# EAGLE design TController (EAGLE 7.7.0)
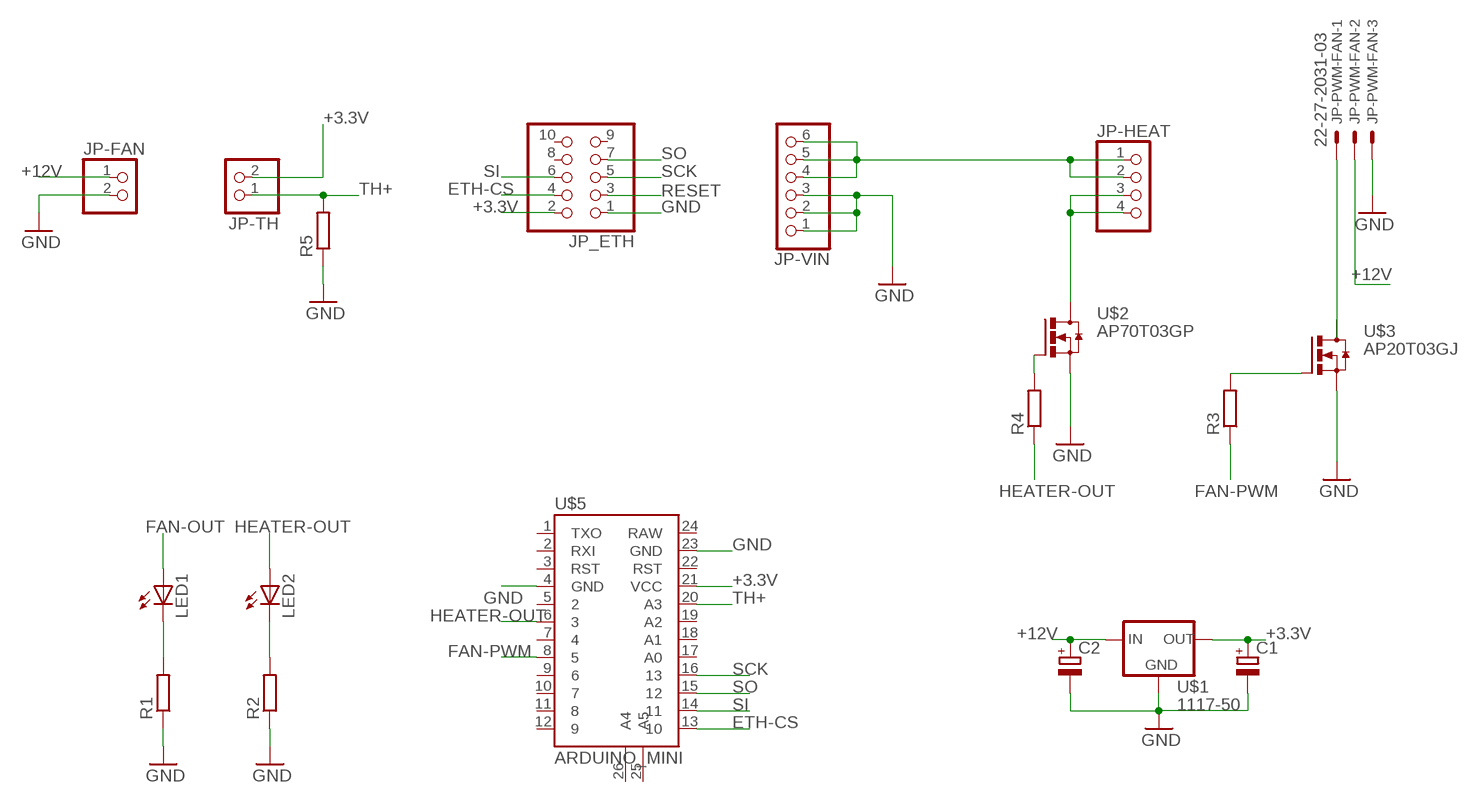
[diagram p0: schematic, sheet 1]

## Parts
C1  CPOL-EUE2.5-6  [E2,5-6]
C2  CPOL-EUE2.5-6  [E2,5-6]
JP-FAN  PINHD-1X2  [1X02]
JP-HEAT  PINHD-1X4  [1X04]
JP-PWM-FAN  22-27-2031-03  [6410-03]
JP-TH  PINHD-1X2  [1X02]
JP-VIN  PINHD-1X6  [1X06]
JP_ETH  PINHD-2X5  [2X05]
LED1  LED3MM  [LED3MM]
LED2  LED3MM  [LED3MM]
R1  R-EU_0207/10  [0207/10]
R2  R-EU_0207/10  [0207/10]
R3  R-EU_0207/10  [0207/10]
R4  R-EU_0207/10  [0207/10]
R5  R-EU_0207/10  [0207/10]
U$1  1117-50  [SOT223]
U$2  AP70T03GP  [TO220V]
U$3  AP20T03GJ  [TO-251]
U$5  ARDUINO_MINI  [ARDUINO_MINI]

## Nets
+3.3V: C1.+ JP-TH.2 JP_ETH.2 U$1.2(OUT) U$1.4(OUT) U$5.21(VCC)
+12V: C2.+ JP-FAN.1 JP-HEAT.1 JP-HEAT.2 JP-PWM-FAN.2 JP-VIN.4 JP-VIN.5 JP-VIN.6 U$1.3(IN)
ETH-CS: JP_ETH.4 U$5.13
FAN-OUT: LED1.A
FAN-PWM: R3.1 U$5.8
GND: C1.- C2.- JP-FAN.2 JP-PWM-FAN.3 JP-VIN.1 JP-VIN.2 JP-VIN.3 JP_ETH.1 R1.1 R2.1 R5.1 U$1.1(GND) U$2.3(S) U$3.S U$5.4(GND) U$5.23(GND)
HEATER-OUT: LED2.A R4.1 U$5.6
N$1: R3.2 U$3.G
N$2: R4.2 U$2.1(G)
N$3: JP-PWM-FAN.1 U$3.D
N$7: JP-HEAT.3 JP-HEAT.4 U$2.2(D)
N$8: LED1.K(C) R1.2
N$9: LED2.K(C) R2.2
RESET: JP_ETH.3
SCK: JP_ETH.5 U$5.16
SI: JP_ETH.6 U$5.14
SO: JP_ETH.7 U$5.15
TH+: JP-TH.1 R5.2 U$5.20(A3)
Unconnected: JP_ETH.8 JP_ETH.9 JP_ETH.10 U$5.1(TXO) U$5.2(RXI) U$5.3(RST) U$5.5 U$5.7 U$5.9 U$5.10 U$5.11 U$5.12 U$5.17(A0) U$5.18(A1) U$5.19(A2) U$5.22(RST) U$5.24(RAW) U$5.25(A5) U$5.26(A4)

## Library data of the parts
C1 C2 = resistor:CPOL-EU: POLARIZED CAPACITOR, European symbol
JP-FAN JP-TH = pinhead:PINHD-1X2: PIN HEADER
JP-HEAT = pinhead:PINHD-1X4: PIN HEADER
JP-PWM-FAN = con-molex:22-?-03: CONNECTOR wire to board 2.54 mm (.1 inch) pitch header; OC_FARNELL: unknown; OC_NEWARK: unknown
JP-VIN = pinhead:PINHD-1X6: PIN HEADER
JP_ETH = pinhead:PINHD-2X5: PIN HEADER
LED1 LED2 = led:LED: LED OSRAM: - CHIPLED LG R971, LG N971, LY N971, LG Q971, LY Q971, LO R971, LY R971 LH N974, LH R974 LS Q976, LO Q976, LY Q976 LO Q996 - Hyper CHIPLED LW Q18S LB Q993, LB Q99A, LB R99A - SideLED LS A670, LO A670, LY A670, LG A670, LP A670 LB A673, LV A673, LT A673, LW A673 LH A674 LY A675 LS A676, LA A676, LO A676, LY A676, LW A676 LS A679, LY A679, LG A679 - Hyper Micro SIDELED® LS Y876, LA Y876, LO Y876, LY Y876 LT Y87S - SmartLED LW L88C, LW L88S LB L89C, LB L89S, LG L890 LS L89K, LO L89K, LY L89K LS L896, LA L896, LO L896, LY L896 - TOPLED LS T670, LO T670, LY T670, LG T670, LP T670 LSG T670, LSP T670, LSY T670, LOP T670, LYG T670 LG T671, LOG T671, LSG T671 LB T673, LV T673, LT T673, LW T673 LH T674 LS T676, LA T676, LO T676, LY T676, LB T676, LH T676, LSB T676, LW T676 LB T67C, LV T67C, LT T67C, LS T67K, LO T67K, LY T67K, LW E67C LS E67B, LA E67B, LO E67B, LY E67B, LB E67C, LV E67C, LT E67C LW T67C LS T679, LY T679, LG T679 LS T770, LO T770, LY T770, LG T770, LP T770 LB T773, LV T773, LT T773, LW T773 LH T774 LS E675, LA E675, LY E675, LS T675 LS T776, LA T776, LO T776, LY T776, LB T776 LHGB T686 LT T68C, LB T68C - Hyper Mini TOPLED® LB M676 - Mini TOPLED Santana® LG M470 LS M47K, LO M47K, LY M47K Source: http://www.osram.convergy.de LUXEON: - LUMILED® LXK2-PW12-R00, LXK2-PW12-S00, LXK2-PW14-U00, LXK2-PW14-V00 LXK2-PM12-R00, LXK2-PM12-S00, LXK2-PM14-U00 LXK2-PE12-Q00, LXK2-PE12-R00, LXK2-PE12-S00, LXK2-PE14-T00, LXK2-PE14-U00 LXK2-PB12-K00, LXK2-PB12-L00, LXK2-PB12-M00, LXK2-PB14-N00, LXK2-PB14-P00, LXK2-PB14-Q00 LXK2-PR12-L00, LXK2-PR12-M00, LXK2-PR14-Q00, LXK2-PR14-R00 LXK2-PD12-Q00, LXK2-PD12-R00, LXK2-PD12-S00 LXK2-PH12-R00, LXK2-PH12-S00 LXK2-PL12-P00, LXK2-PL12-Q00, LXK2-PL12-R00 Source: www.luxeon.com KINGBRIGHT: KA-3528ASYC Source: www.kingbright.com
R1-R5 = resistor:R-EU_: RESISTOR, European symbol
U$1 = pedro:1117-50: 1117-xx voltage regulator
U$2 = pedro:AP70T03GP: AP20T03GJ power N-Channel mosfet
U$3 = pedro:AP20T03GJ: AP20T03GJ power N-Channel mosfet
U$5 = pedro:ARDUINO_MINI: Arduino Pro Mini footprint

## Net classes
0 default: clearance 0.205 mm

## Board
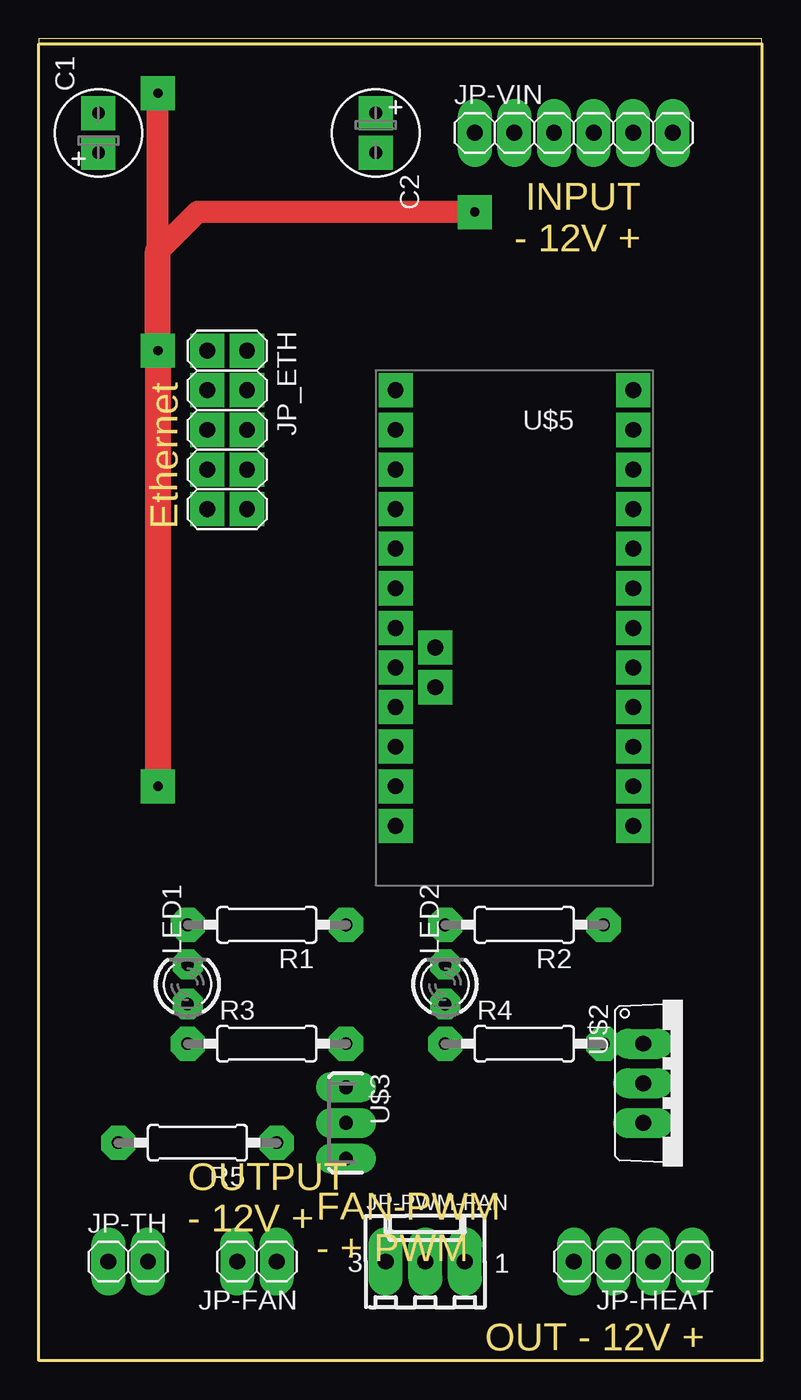
[diagram p1: board, top side]
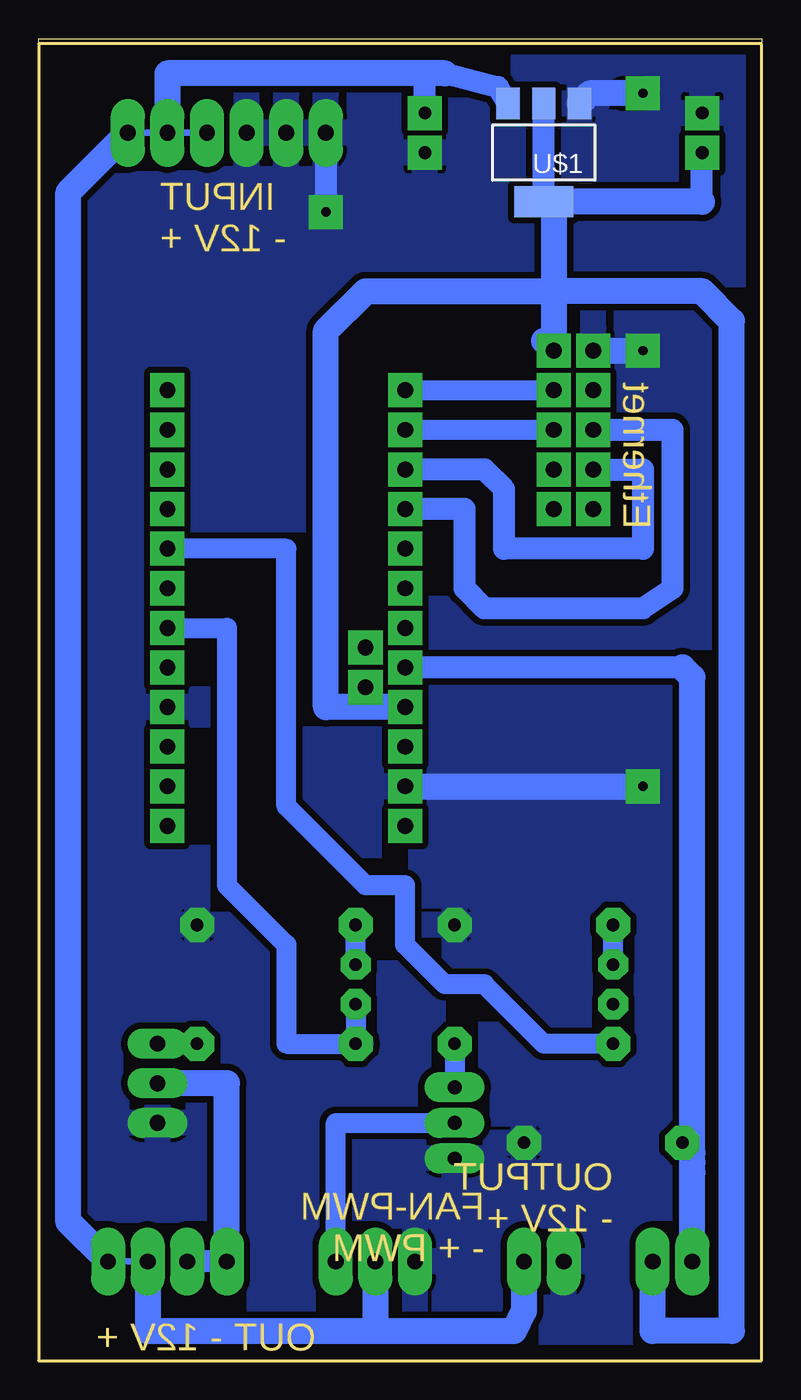
[diagram p2: board, bottom side, seen from below]

Size 46.34 x 84.76 mm. Coordinates in mm from the lower left corner, seen from the top.
Outline: 0,0 46.34,0 46.34,84.76 0,84.76 0,0
Copper layers (1*16): Top 0.035mm / dielectric 1.5mm / Bottom 0.035mm
Design rules "default": minimum track width 10mil, minimum drill 24mil, track to track 8mil, track to pad 8mil, pad to pad 8mil, via to via 8mil, smd to smd 8mil, copper to edge 40mil, drill to drill 8mil, minimum pad ring 10mil, minimum via ring 8mil, stop-mask expansion 4mil, vias tented up to drill 0mil, thermal gap 10mil
Milling: 4 lines

### Footprints (pad centres in the part's own frame; a part is rotated, then mirrored left to right if it is on the bottom)
E2,5-6 = drill 0.813 pad 2.184 square: + -1.27,0; - 1.27,0
1X02 = drill 1.016 pad 2.184 long: 1 -1.27,0; 2 1.27,0
1X04 = drill 1.016 pad 2.184 long: 1 -3.81,0; 2 -1.27,0; 3 1.27,0; 4 3.81,0
6410-03 = drill 1.016 pad 2.184 long: 1 2.54,0; 2 0,0; 3 -2.54,0
1X06 = drill 1.016 pad 2.184 long: 1 -6.35,0; 2 -3.81,0; 3 -1.27,0; 4 1.27,0; 5 3.81,0; 6 6.35,0
2X05 = drill 1.016 pad 2.184 square: 1 -5.08,-1.27; 2 -5.08,1.27; 3 -2.54,-1.27; 4 -2.54,1.27; 5 0,-1.27; 6 0,1.27; 7 2.54,-1.27; 8 2.54,1.27; 9 5.08,-1.27; 10 5.08,1.27
LED3MM = drill 0.813 pad 1.93 octagon: A -1.27,0; K 1.27,0
0207/10 = drill 0.813 pad 2.184 octagon: 1 -5.08,0; 2 5.08,0
SOT223 = smd 1.5 x 2: 1 -2.3,-3.15; 2 0,-3.15; 3 2.3,-3.15 | smd 3.8 x 2: 4 0,3.15
TO220V = drill 1.016 pad 1.93 long: 1 -3.81,1.27; 2 -1.27,1.27; 3 1.27,1.27
TO-251 = drill 0.889 pad 1.93 long: D -1.27,0; G -3.556,0; S 1.016,0
ARDUINO_MINI = drill 1.016 pad 2.184 square: 1 -7.62,12.7; 2 -7.62,10.16; 3 -7.62,7.62; 4 -7.62,5.08; 5 -7.62,2.54; 6 -7.62,0; 7 -7.62,-2.54; 8 -7.62,-5.08; 9 -7.62,-7.62; 10 -7.62,-10.16; 11 -7.62,-12.7; 12 -7.62,-15.24; 13 7.62,-15.24; 14 7.62,-12.7; 15 7.62,-10.16; 16 7.62,-7.62; 17 7.62,-5.08; 18 7.62,-2.54; 19 7.62,0; 20 7.62,2.54; 21 7.62,5.08; 22 7.62,7.62; 23 7.62,10.16; 24 7.62,12.7; 25 5.08,3.81; 26 5.08,1.27

### Placement (x,y rotation side)
C1  3.81,78.74 90 top
C2  21.59,78.74 270 top
JP-FAN  13.97,6.35 180 top
JP-HEAT  38.1,6.35 180 top
JP-PWM-FAN  24.77,6.35 0 top
JP-TH  5.71,6.35 0 top
JP-VIN  34.29,78.74 0 top
JP_ETH  12.06,59.69 270 top
LED1  9.53,24.13 90 top
LED2  26.04,24.13 90 top
R1  14.61,27.94 180 top
R2  31.11,27.94 180 top
R3  14.61,20.32 0 top
R4  31.11,20.32 0 top
R5  10.16,13.97 180 top
U$1  13.97,77.47 180 bottom
U$2  37.47,16.51 270 top
U$3  19.68,13.97 270 top
U$5  30.48,46.99 180 top

### Tracks (layer width: path | path; a pad name or v marks a point on that pad's centre or on a via)
+3.3V
  Bottom 1.422: U$1.4 U$1.2 | 3.83,74.32 3.83,77.44 C1.+
  Bottom 1.676: 13.97,65.41 JP_ETH.2 13.34,68.58 | U$5.21 27.94,41.91 27.94,66.04 25.4,68.58 13.34,68.58 | 3.83,74.32 U$1.4 13.34,73.69 13.34,68.58 | 13.34,68.58 3.81,68.58 1.91,66.67 1.91,1.91 6.99,1.91 JP-TH.2
+12V
  Bottom 0.406: JP-VIN.6 JP-VIN.5 JP-VIN.4 | JP-HEAT.1 JP-HEAT.2
  Bottom 1.422: 20.32,82.55 16.91,81.67 U$1.3 | C2.+ 21.59,82.55
  Bottom 1.676: 20.32,82.55 21.59,82.55 38.1,82.55 JP-VIN.5 | JP-HEAT.1 44.45,8.89 44.45,74.93 JP-VIN.6 | JP-HEAT.2 39.37,1.91 24.77,1.91 | JP-FAN.1 15.24,3.17 15.88,1.91 24.77,1.91 | JP-PWM-FAN.2 24.77,1.91
ETH-CS
  Bottom 1.27: U$5.13 JP_ETH.4
FAN-PWM
  Bottom 1.27: R3.1 13.97,20.32 17.78,24.13 20.32,24.13 22.86,26.67 22.86,30.48 25.4,30.48 30.48,35.56 30.48,52.07 U$5.8
GND  (via drill 0.6 pad 2.18)
  Top 1.422: v27.94,73.66 10.16,73.66 7.62,71.12 v7.62,81.28
  Top 1.676: 7.62,71.12 v7.62,64.77 v7.62,36.83
  Bottom 1.422: JP-VIN.1 v27.94,73.66
  Bottom 1.676: JP_ETH.1 v7.62,64.77 | U$5.23 v7.62,36.83 | v7.62,81.28 11.01,81.28 U$1.1
  pour Bottom (isolate 0.406): -1.27,83.82 45.72,83.82 46.99,0 0,0
HEATER-OUT
  Bottom 1.016: 25.4,20.32 R4.1
  Bottom 1.27: LED2.A R4.1 30.48,20.32 30.48,26.67 34.29,30.48 34.29,46.99 U$5.6
N$1
  Bottom 1.27: R3.2 U$3.G
N$2
  Bottom 1.27: R4.2 U$2.1
N$3
  Bottom 1.27: JP-PWM-FAN.1 27.3,15.24 U$3.D
N$5
  Bottom 1.422: 7.62,81.28 8.89,81.28
N$7
  Bottom 1.422: JP-HEAT.4 JP-HEAT.3
  Bottom 1.676: JP-HEAT.4 34.29,17.78 U$2.2
N$8
  Bottom 1.27: LED1.K R1.2
N$9
  Bottom 1.27: LED2.K R2.2
SCK
  Bottom 1.422: JP_ETH.5 5.71,59.69 5.71,49.53 7.62,48.26 17.78,48.26 19.05,49.53 19.05,54.61 U$5.16
SI
  Bottom 1.27: JP_ETH.6 U$5.14
SO
  Bottom 1.422: JP_ETH.7 7.62,57.15 7.62,52.07 16.51,52.07 16.51,55.88 17.78,57.15 U$5.15
TH+
  Bottom 1.422: 5.08,44.45 U$5.20
  Bottom 1.676: 4.45,13.34 4.45,43.81 5.08,44.45 | 4.45,13.34 4.45,12.7 4.45,12.06 JP-TH.1 | 4.45,13.34 R5.2

### Text on the board
Milling: INPUT / - 12V + | Ethernet | OUTPUT / - 12V + | FAN-PWM / - + PWM | OUT - 12V +